# EAGLE design CB_v1 (EAGLE 7.1.0)
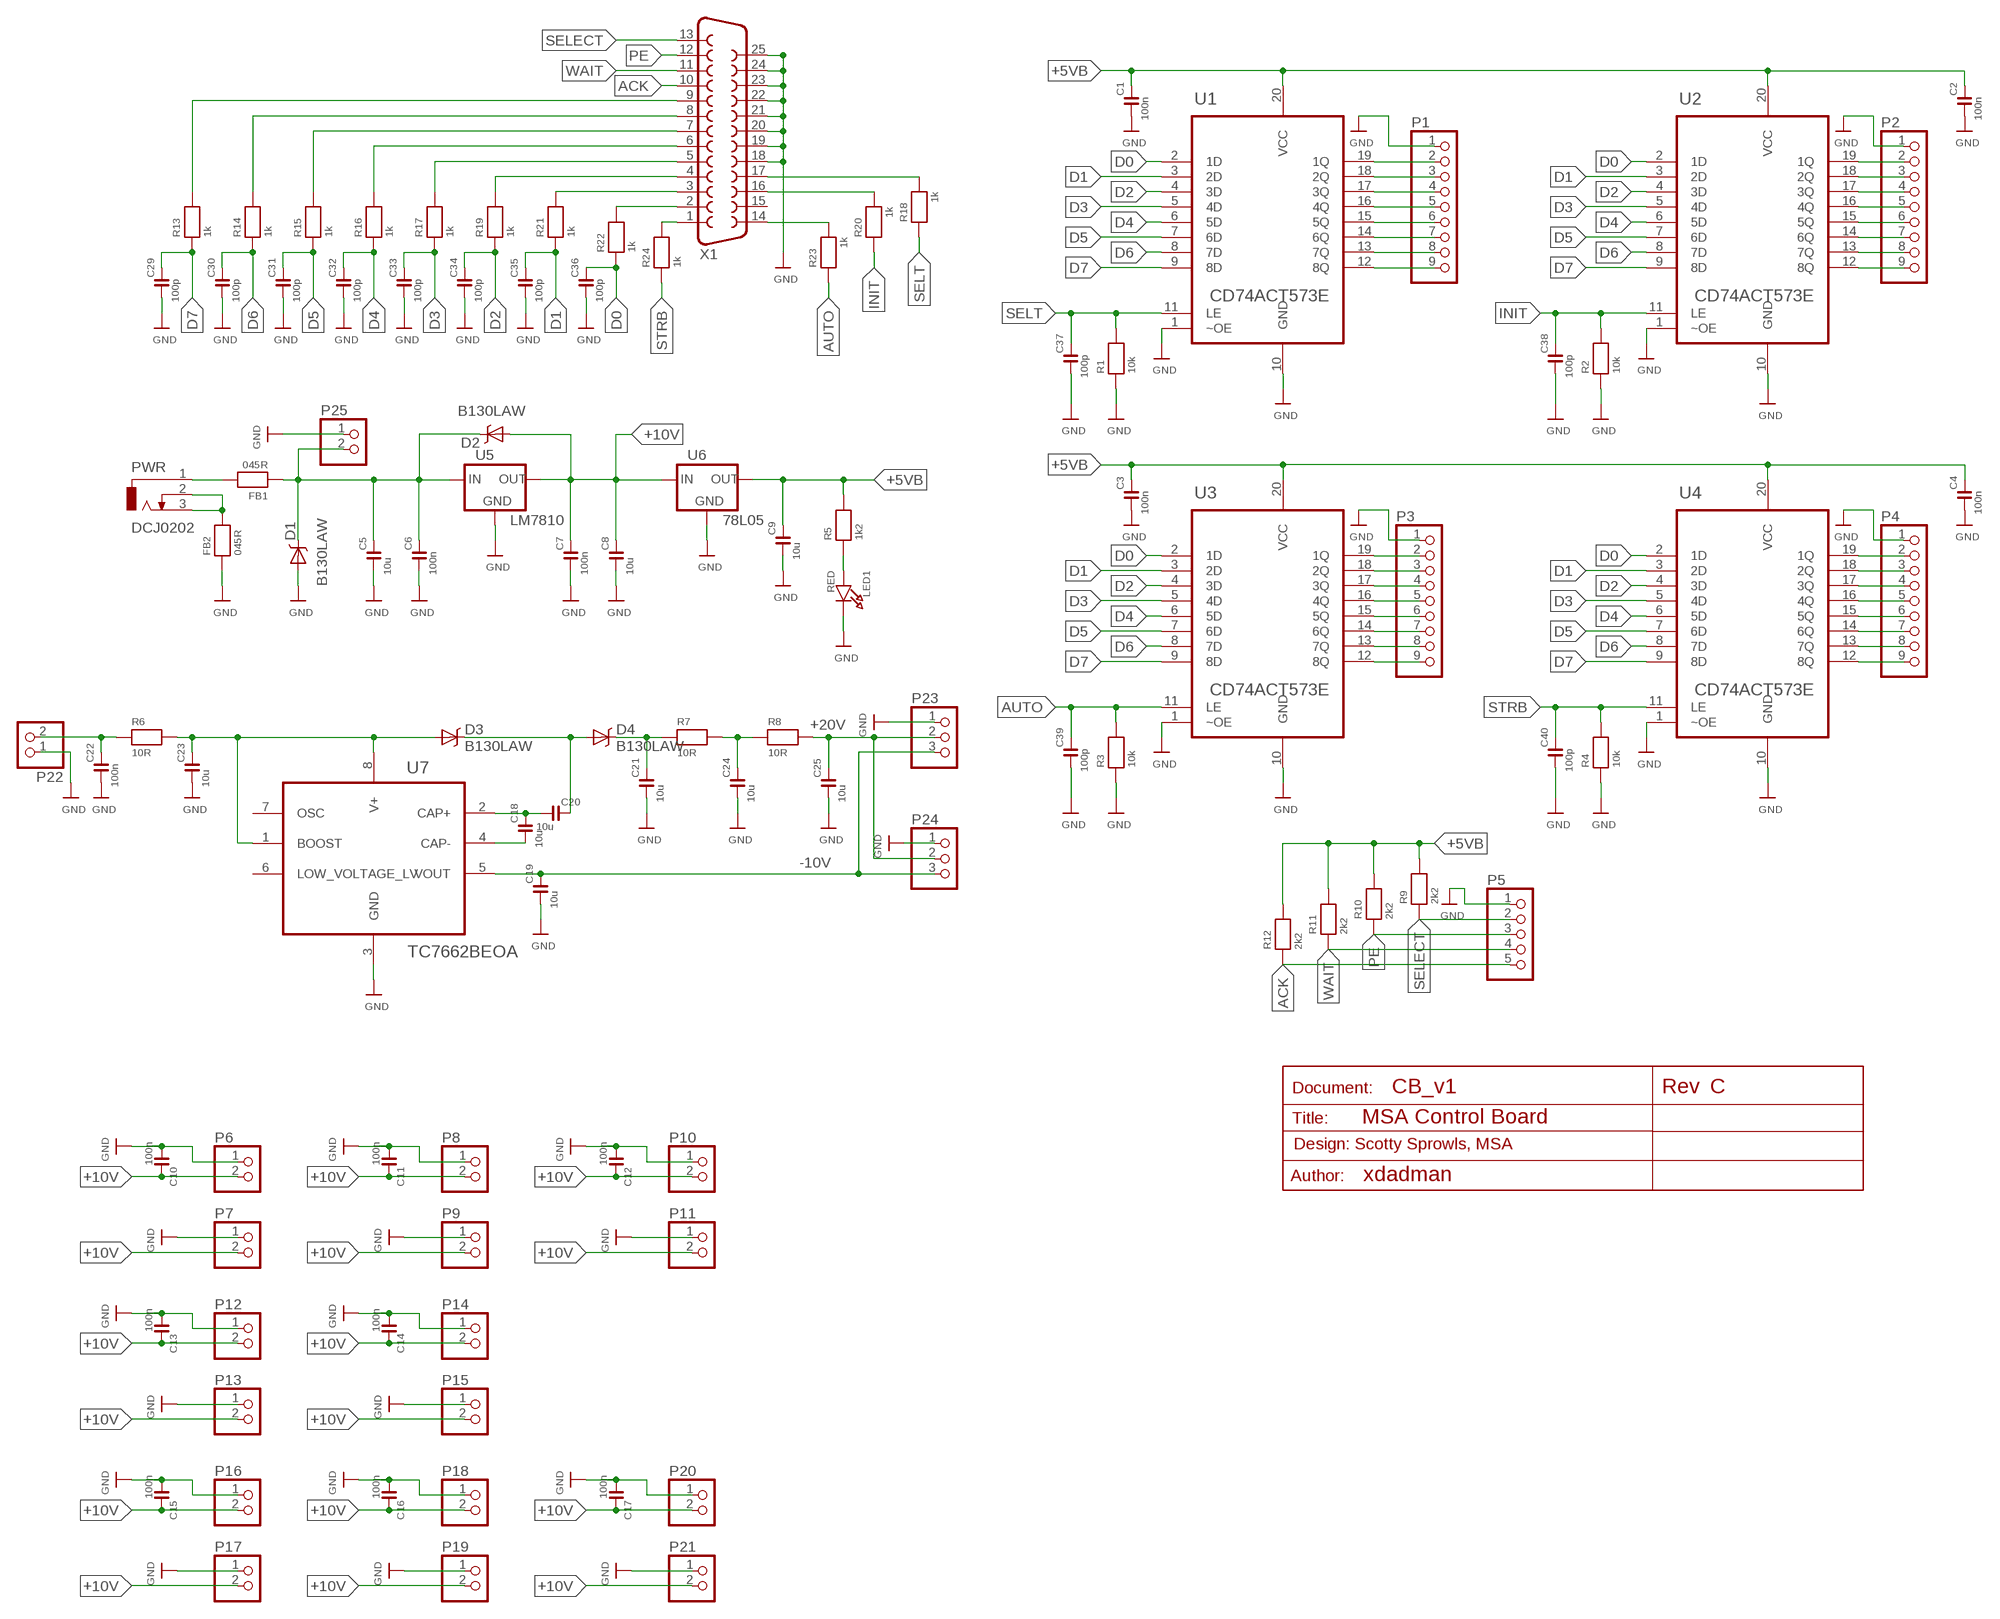
[diagram p0: schematic, sheet 1]

## Parts
C1  100n  C0805100N  [C0805]
C2  100n  C0805100N  [C0805]
C3  100n  C0805100N  [C0805]
C4  100n  C0805100N  [C0805]
C5  10u  CC120610U  [C1206]
C6  100n  C0805100N  [C0805]
C7  100n  C0805100N  [C0805]
C8  10u  CC120610U  [C1206]
C9  10u  CC120610U  [C1206]
C10  100n  C0805100N  [C0805]
C11  100n  C0805100N  [C0805]
C12  100n  C0805100N  [C0805]
C13  100n  C0805100N  [C0805]
C14  100n  C0805100N  [C0805]
C15  100n  C0805100N  [C0805]
C16  100n  C0805100N  [C0805]
C17  100n  C0805100N  [C0805]
C18  10u  CC120610U  [C1206]
C19  10u  CC120610U  [C1206]
C20  10u  CC120610U  [C1206]
C21  10u  CC120610U  [C1206]
C22  100n  C0805100N  [C0805]
C23  10u  CC120610U  [C1206]
C24  10u  CC120610U  [C1206]
C25  10u  CC120610U  [C1206]
C29  100p  C0805100P  [C0805]
C30  100p  C0805100P  [C0805]
C31  100p  C0805100P  [C0805]
C32  100p  C0805100P  [C0805]
C33  100p  C0805100P  [C0805]
C34  100p  C0805100P  [C0805]
C35  100p  C0805100P  [C0805]
C36  100p  C0805100P  [C0805]
C37  100p  C0805100P  [C0805]
C38  100p  C0805100P  [C0805]
C39  100p  C0805100P  [C0805]
C40  100p  C0805100P  [C0805]
D1  B130LAW  B130LAW-7-FB130LAW-7-F  [SOD-123]
D2  B130LAW  B130LAW-7-FB130LAW-7-F  [SOD-123]
D3  B130LAW  B130LAW-7-FB130LAW-7-F  [SOD-123]
D4  B130LAW  B130LAW-7-FB130LAW-7-F  [SOD-123]
FB1  045R  R0805FB045  [R0805]
FB2  045R  R0805FB045  [R0805]
LED1  RED  LED_0603_RED0603  [CHIPLED_0603]
P1  PINHD-1X9  [1X09ROUND]
P2  PINHD-1X9  [1X09ROUND]
P3  PINHD-1X9  [1X09ROUND]
P4  PINHD-1X9  [1X09ROUND]
P5  PINHD-1X5  [1X05]
P6  PINHD-1X2  [1X02]
P7  PINHD-1X2  [1X02]
P8  PINHD-1X2  [1X02]
P9  PINHD-1X2  [1X02]
P10  PINHD-1X2  [1X02]
P11  PINHD-1X2  [1X02]
P12  PINHD-1X2  [1X02]
P13  PINHD-1X2  [1X02]
P14  PINHD-1X2  [1X02]
P15  PINHD-1X2  [1X02]
P16  PINHD-1X2  [1X02]
P17  PINHD-1X2  [1X02]
P18  PINHD-1X2  [1X02]
P19  PINHD-1X2  [1X02]
P20  PINHD-1X2  [1X02]
P21  PINHD-1X2  [1X02]
P22  PINHD-1X2  [1X02]
P23  PINHD-1X3  [1X03]
P24  PINHD-1X3  [1X03]
P25  PINHD-1X2  [1X02]
PWR  DCJ0202  [DCJ0202]
R1  10k  R080510K  [R0805]
R2  10k  R080510K  [R0805]
R3  10k  R080510K  [R0805]
R4  10k  R080510K  [R0805]
R5  1k2  R08051K2  [R0805]
R6  10R  R080510R  [R0805]
R7  10R  R080510R  [R0805]
R8  10R  R080510R  [R0805]
R9  2k2  R08052K2  [R0805]
R10  2k2  R08052K2  [R0805]
R11  2k2  R08052K2  [R0805]
R12  2k2  R08052K2  [R0805]
R13  1k  R08051K  [R0805]
R14  1k  R08051K  [R0805]
R15  1k  R08051K  [R0805]
R16  1k  R08051K  [R0805]
R17  1k  R08051K  [R0805]
R18  1k  R08051K  [R0805]
R19  1k  R08051K  [R0805]
R20  1k  R08051K  [R0805]
R21  1k  R08051K  [R0805]
R22  1k  R08051K  [R0805]
R23  1k  R08051K  [R0805]
R24  1k  R08051K  [R0805]
U1  CD74ACT573E  [DIP254P762X508-20]
U2  CD74ACT573E  [DIP254P762X508-20]
U3  CD74ACT573E  [DIP254P762X508-20]
U4  CD74ACT573E  [DIP254P762X508-20]
U5  LM7810  78MXXLLM7810  [TO220V]
U6  78L05  78MXXL78L05  [SOT89]
U7  TC7662BEOA  [SOIC127P600X175-8N_JDA]
X1  F25D  [F25D]

## Nets
+5VB: C1.2 C2.2 C3.2 C4.2 C9.2 R5.2 R9.2 R10.2 R11.2 R12.2 U1.20(VCC) U2.20(VCC) U3.20(VCC) U4.20(VCC) U6.1(OUT)
+10V: C7.2 C8.2 C10.2 C11.2 C12.2 C13.2 C14.2 C15.2 C16.2 C17.2 D2.A P6.2 P7.2 P8.2 P9.2 P10.2 P11.2 P12.2 P13.2 P14.2 P15.2 P16.2 P17.2 P18.2 P19.2 P20.2 P21.2 U5.3(OUT) U6.3(IN)
+20V: C25.2 P23.2 P24.2 R8.2
-10V: C19.2 P23.3 P24.3 U7.5(VOUT)
ACK: P5.5 R12.1 X1.10
AUTO: C39.2 R3.2 R23.2 U3.11(LE)
D0: C36.2 R22.1 U1.2(1D) U2.2(1D) U3.2(1D) U4.2(1D)
D1: C35.2 R21.1 U1.3(2D) U2.3(2D) U3.3(2D) U4.3(2D)
D2: C34.2 R19.1 U1.4(3D) U2.4(3D) U3.4(3D) U4.4(3D)
D3: C33.2 R17.1 U1.5(4D) U2.5(4D) U3.5(4D) U4.5(4D)
D4: C32.2 R16.1 U1.6(5D) U2.6(5D) U3.6(5D) U4.6(5D)
D5: C31.2 R15.1 U1.7(6D) U2.7(6D) U3.7(6D) U4.7(6D)
D6: C30.2 R14.1 U1.8(7D) U2.8(7D) U3.8(7D) U4.8(7D)
D7: C29.2 R13.1 U1.9(8D) U2.9(8D) U3.9(8D) U4.9(8D)
GND: C1.1 C2.1 C3.1 C4.1 C5.1 C6.1 C7.1 C8.1 C9.1 C10.1 C11.1 C12.1 C13.1 C14.1 C15.1 C16.1 C17.1 C19.1 C21.1 C22.1 C23.1 C24.1 C25.1 C29.1 C30.1 C31.1 C32.1 C33.1 C34.1 C35.1 C36.1 C37.1 C38.1 C39.1 C40.1 D1.A FB2.1 LED1.C P1.1 P2.1 P3.1 P4.1 P5.1 P6.1 P7.1 P8.1 P9.1 P10.1 P11.1 P12.1 P13.1 P14.1 P15.1 P16.1 P17.1 P18.1 P19.1 P20.1 P21.1 P22.1 P23.1 P24.1 P25.1 R1.1 R2.1 R3.1 R4.1 U1.1(~OE) U1.10(GND) U2.1(~OE) U2.10(GND) U3.1(~OE) U3.10(GND) U4.1(~OE) U4.10(GND) U5.2(GND) U6.2(GND) U6.4(GND) U7.3(GND) X1.18 X1.19 X1.20 X1.21 X1.22 X1.23 X1.24 X1.25
INIT: C38.2 R2.2 R20.2 U2.11(LE)
N$1: P1.2 U1.19(1Q)
N$2: P3.2 U3.19(1Q)
N$3: P2.2 U2.19(1Q)
N$4: P4.2 U4.19(1Q)
N$5: R22.2 X1.2
N$6: R18.1 X1.17
N$7: R21.2 X1.3
N$8: R19.2 X1.4
N$9: R13.2 X1.9
N$10: R23.1 X1.14
N$11: R20.1 X1.16
N$12: R14.2 X1.8
N$13: R15.2 X1.7
N$14: R16.2 X1.6
N$15: R17.2 X1.5
N$16: FB1.2 PWR.1
N$17: P1.3 U1.18(2Q)
N$18: P1.4 U1.17(3Q)
N$19: R24.2 X1.1
N$20: FB2.2 PWR.2 PWR.3
N$21: C5.2 C6.2 D1.C D2.C FB1.1 P25.2 U5.1(IN)
N$22: LED1.A R5.1
N$23: C23.2 D3.A R6.2 U7.1(BOOST) U7.8(V+)
N$24: C22.2 P22.2 R6.1
N$25: C20.2 D3.C D4.A
N$26: C21.2 D4.C R7.1
N$27: P1.5 U1.16(4Q)
N$28: C18.1 U7.4(CAP-)
N$30: C18.2 C20.1 U7.2(CAP+)
N$31: C24.2 R7.2 R8.1
N$33: P1.6 U1.15(5Q)
N$34: P1.7 U1.14(6Q)
N$35: P1.8 U1.13(7Q)
N$36: P1.9 U1.12(8Q)
N$37: P2.3 U2.18(2Q)
N$38: P2.4 U2.17(3Q)
N$39: P2.5 U2.16(4Q)
N$40: P2.6 U2.15(5Q)
N$41: P2.7 U2.14(6Q)
N$42: P2.8 U2.13(7Q)
N$43: P2.9 U2.12(8Q)
N$44: P3.3 U3.18(2Q)
N$45: P3.4 U3.17(3Q)
N$46: P3.5 U3.16(4Q)
N$47: P3.6 U3.15(5Q)
N$48: P3.7 U3.14(6Q)
N$49: P3.8 U3.13(7Q)
N$50: P3.9 U3.12(8Q)
N$51: P4.3 U4.18(2Q)
N$52: P4.4 U4.17(3Q)
N$53: P4.5 U4.16(4Q)
N$54: P4.6 U4.15(5Q)
N$55: P4.7 U4.14(6Q)
N$56: P4.8 U4.13(7Q)
N$57: P4.9 U4.12(8Q)
PE: P5.3 R10.1 X1.12
SELECT: P5.2 R9.1 X1.13
SELT: C37.2 R1.2 R18.2 U1.11(LE)
STRB: C40.2 R4.2 R24.1 U4.11(LE)
WAIT: P5.4 R11.1 X1.11
Unconnected: U7.6(LOW_VOLTAGE_LV) U7.7(OSC) X1.15

## Notes on the sheet
- C
- MSA Control Board
- Design: Scotty Sprowls, MSA
- xdadman

## Library data of the parts
C1-C4 C6 C7 C10-C17 C22 = MSA_lib:C0805: Ceramic capacitor; OC_FARNELL: 1759166
C5 C8 C9 C18-C21 C23-C25 = MSA_lib:CC1206: Capacitor ceramic 1206; OC_FARNELL: 1611967
C29-C40 = MSA_lib:C0805: Ceramic capacitor; OC_FARNELL: 1414656
D1-D4 = MSA_lib:B130LAW-7-F: Diode shottky; OC_FARNELL: 1858617
FB1 FB2 = MSA_lib:R0805: Resistors; OC_FARNELL: 1515661
LED1 = MSA_lib:LED_0603_RED: Chip LED 0603 RED 2ma; OC_FARNELL: 1685068
P1-P4 = MSA_lib:PINHD-1X9: PIN HEADER
P5 = MSA_lib:PINHD-1X5: PIN HEADER
P6-P22 P25 = MSA_lib:PINHD-1X2: PIN HEADER
P23 P24 = MSA_lib:PINHD-1X3: PIN HEADER
PWR = MSA_lib:DCJ0202: DC POWER JACK Source: DCJ0202.pdf; OC_FARNELL: unknown; OC_NEWARK: unknown
R1-R4 = MSA_lib:R0805: Resistors; OC_FARNELL: 2073607
R5 = MSA_lib:R0805: Resistors; OC_FARNELL: 9333827
R6-R8 = MSA_lib:R0805: Resistors; OC_FARNELL: 2332043
R9-R12 = MSA_lib:R0805: Resistors; OC_FARNELL: 2332076
R13-R24 = MSA_lib:R0805: Resistors; OC_FARNELL: 2008380
U1-U4 = MSA_lib:CD74ACT573E: OCTAL D- TYPE TRANSPARENT LATCHES WITH 3 STATE OUTPUTS; MPN: CD74ACT573E; OC_FARNELL: 1102996; PACKAGE: 20-DIP; SUPPLIER: Texas Instruments
U5 = MSA_lib:78MXXL: VOLTAGE REGULATOR; OC_FARNELL: 2323459
U6 = MSA_lib:78MXXL: VOLTAGE REGULATOR; OC_FARNELL: 1366573
U7 = MSA_lib:TC7662BEOA: DC-TO-DC VOLTAGE CONVERTER; MPN: TC7662BEOA; OC_FARNELL: 1331515; OC_NEWARK: 75K1581; PACKAGE: SOIC-8; SUPPLIER: Microchip
X1 = MSA_lib:F25: SUB-D; OC_FARNELL: 2294235; OC_NEWARK: unknown

## Board
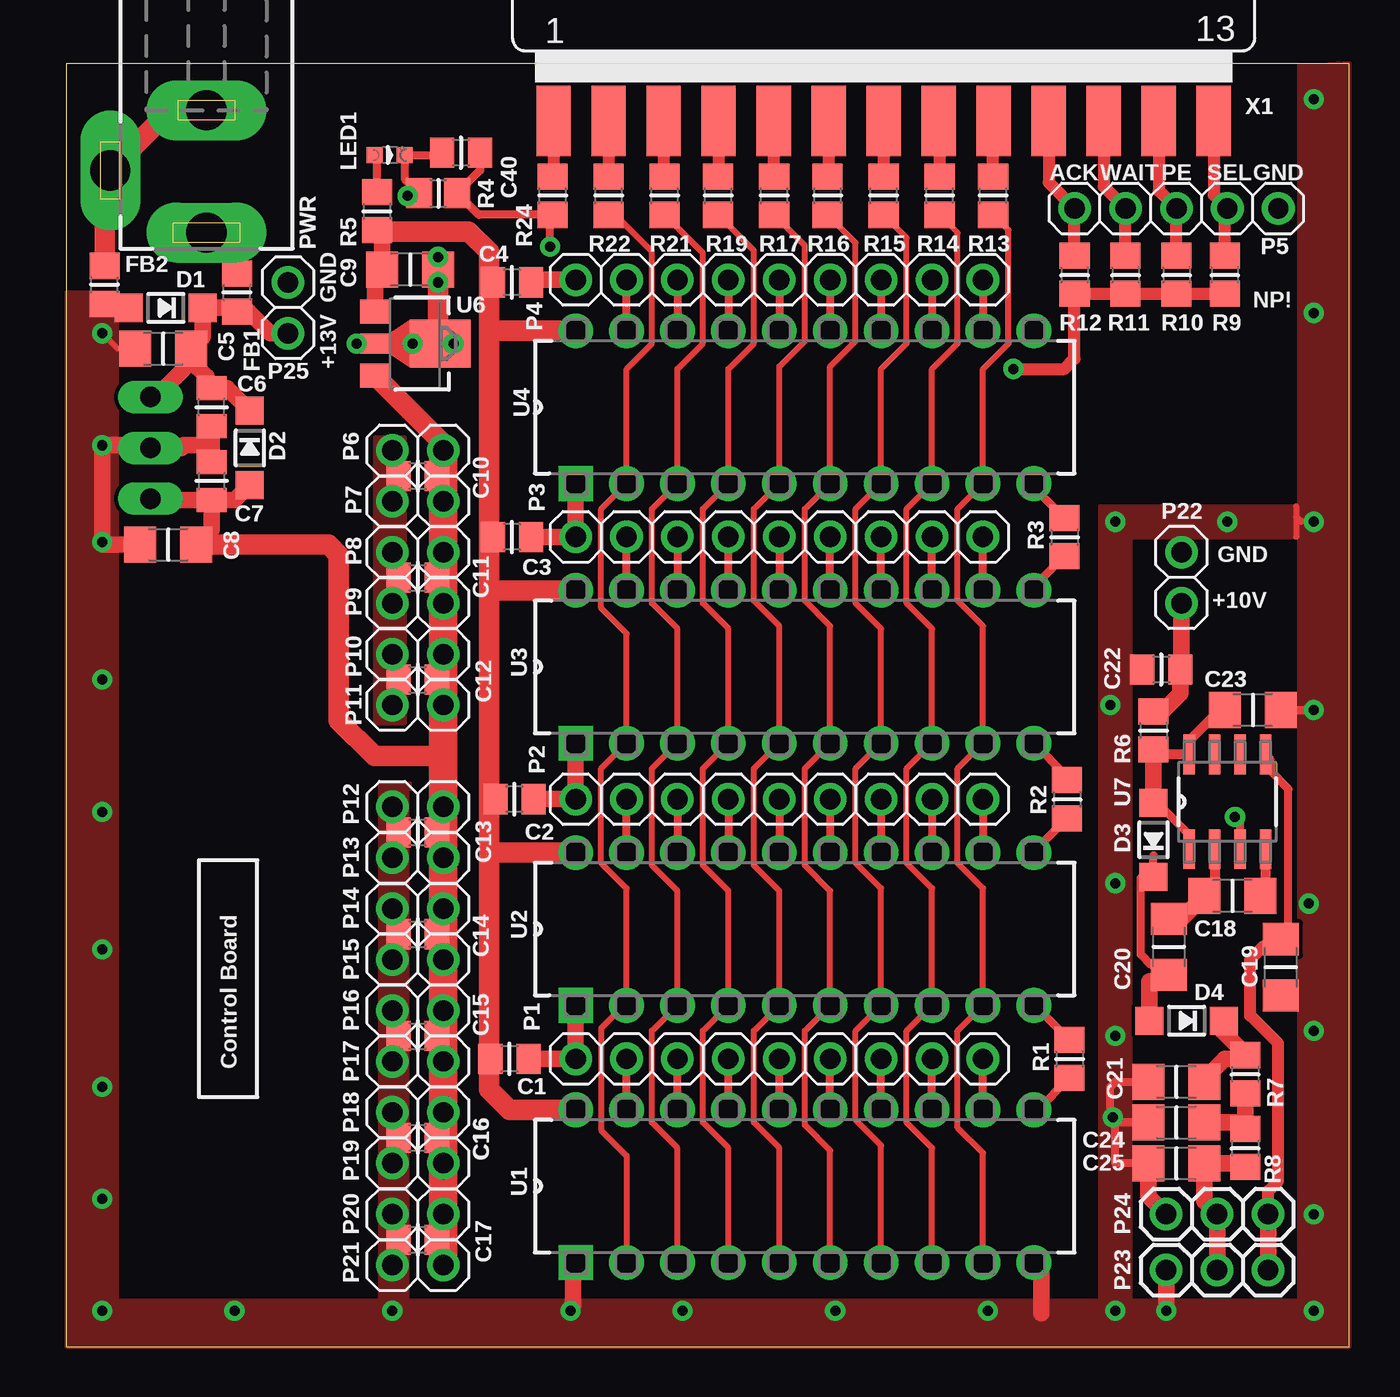
[diagram p1: board, top side]
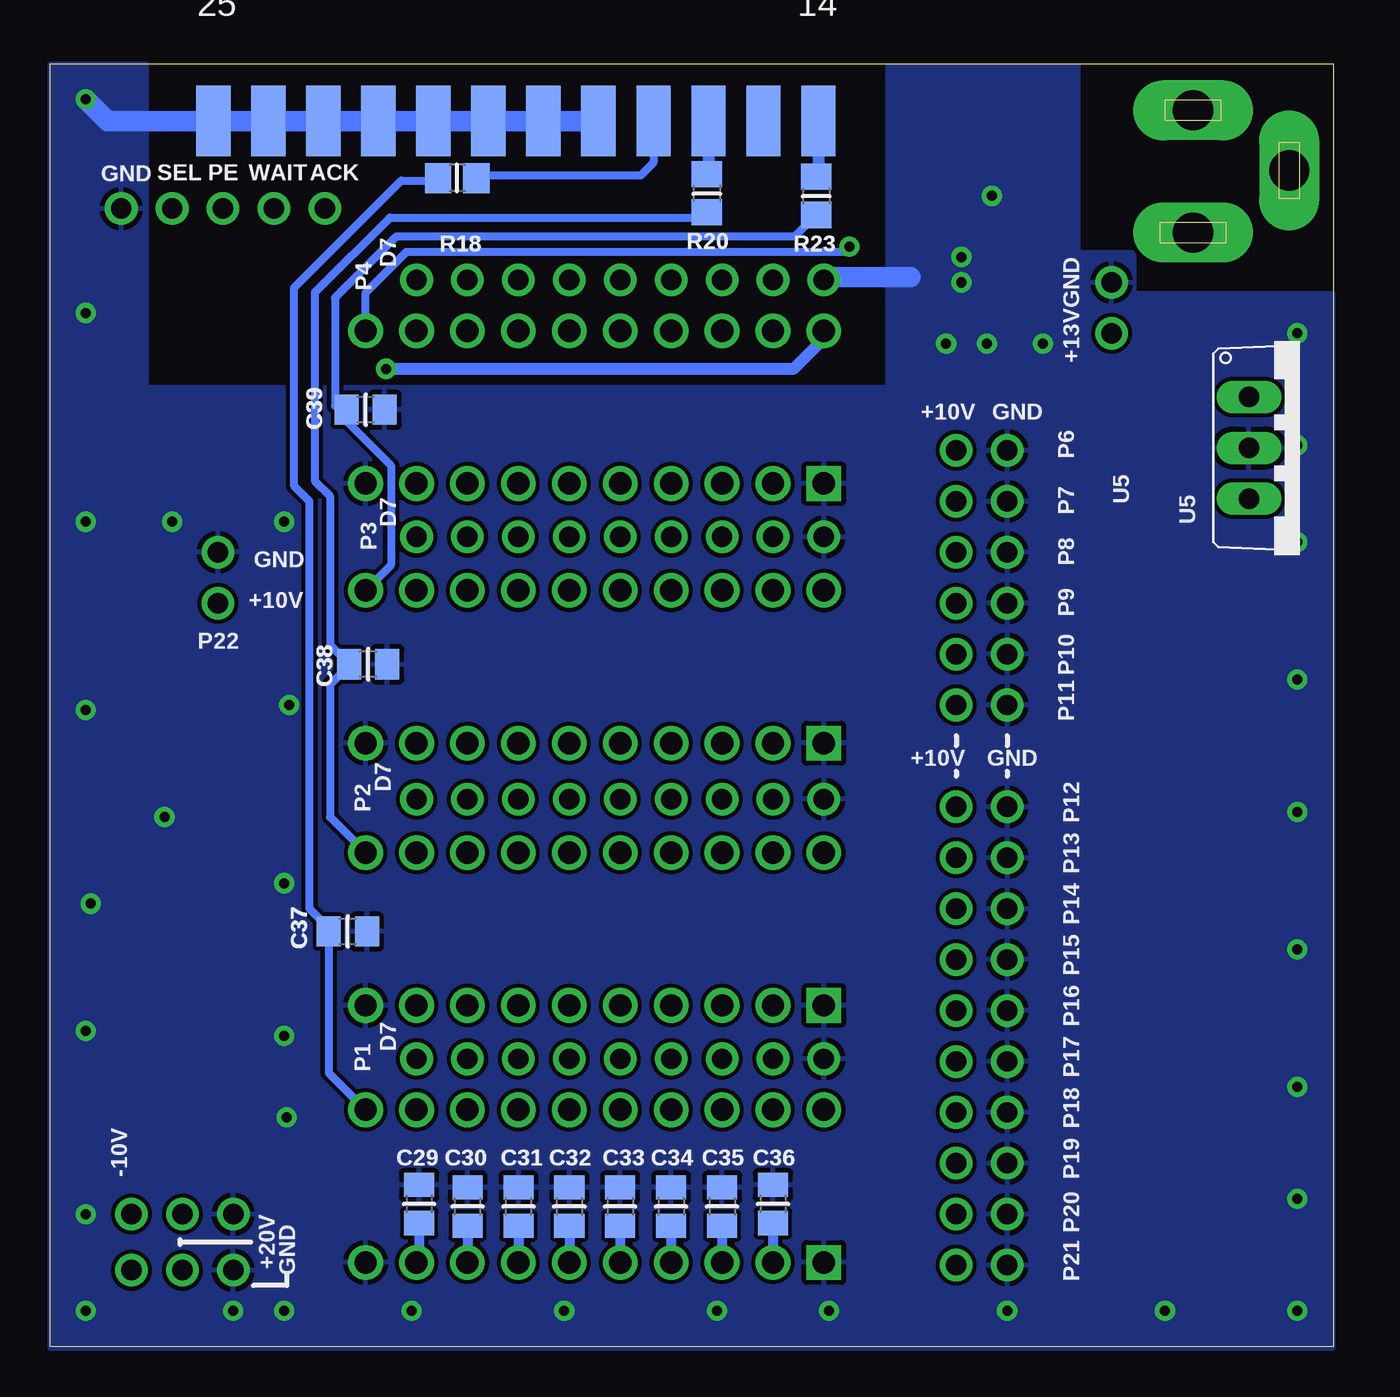
[diagram p2: board, bottom side, seen from below]

Size 64 x 64 mm. Coordinates in mm from the lower left corner, seen from the top.
Outline: 0,0 64,0 64,64 0,64 0,0
Copper layers (1*16): Top 0.035mm / dielectric 1.5mm / Bottom 0.035mm
Design rules "kuba_no_CLR": minimum track width 8mil, minimum drill 15mil, track to track 8mil, track to pad 8mil, pad to pad 8mil, via to via 8mil, smd to smd 8mil, copper to edge 0mil, drill to drill 8mil, minimum pad ring 12mil, minimum via ring 10mil, stop-mask expansion 4mil, vias tented up to drill 0mil, thermal gap 10mil

### Footprints (pad centres in the part's own frame; a part is rotated, then mirrored left to right if it is on the bottom)
C0805 = smd 1.2 x 1.5: 1 -0.953,0; 2 0.953,0
C1206 = smd 1.6 x 1.8: 1 -1.4,0; 2 1.4,0
SOD-123 = smd 1.4 x 1.4: A 1.85,0; C -1.85,0
R0805 = smd 1.3 x 1.5: 1 -0.95,0; 2 0.95,0
CHIPLED_0603 = smd 0.8 x 0.8: A 0,-0.75; C 0,0.75
1X09ROUND = drill 1.016: 1 -10.16,0; 2 -7.62,0; 3 -5.08,0; 4 -2.54,0; 5 0,0; 6 2.54,0; 7 5.08,0; 8 7.62,0; 9 10.16,0
1X05 = drill 1.016: 1 -5.08,0; 2 -2.54,0; 3 0,0; 4 2.54,0; 5 5.08,0
1X02 = drill 1.016: 1 -1.27,0; 2 1.27,0
1X03 = drill 1.016: 1 -2.54,0; 2 0,0; 3 2.54,0
DCJ0202 = drill 2 long: 1 0,3.1; 2 4.8,0; 3 0,-3
DIP254P762X508-20 = drill 1.118 square: 1 -7.62,22.86 | drill 1.118: 2 -7.62,20.32; 3 -7.62,17.78; 4 -7.62,15.24; 5 -7.62,12.7; 6 -7.62,10.16; 7 -7.62,7.62; 8 -7.62,5.08; 9 -7.62,2.54; 10 -7.62,0; 11 0,0; 12 0,2.54; 13 0,5.08; 14 0,7.62; 15 0,10.16; 16 0,12.7; 17 0,15.24; 18 0,17.78; 19 0,20.32; 20 0,22.86
TO220V = drill 1.016 long: 1 -2.54,-2.54; 2 0,-2.54; 3 2.54,-2.54
SOT89 = smd 1.2 x 1.5: 1 -1.6,-2; 3 1.6,-2 | smd 1 x 1.5: 2 0,-2 | smd 2.4 x 3: 4 0,1.25
SOIC127P600X175-8N_JDA = smd 1.981 x 0.559: 1 -2.362,1.905; 2 -2.362,0.635; 3 -2.362,-0.635; 4 -2.362,-1.905; 5 2.362,-1.905; 6 2.362,-0.635; 7 2.362,0.635; 8 2.362,1.905
F25D = smd 1.7 x 3.5: 1 -16.459,-6.045; 2 -13.716,-6.045; 3 -10.973,-6.045; 4 -8.23,-6.045; 5 -5.486,-6.045; 6 -2.743,-6.045; 7 0,-6.045; 8 2.743,-6.045; 9 5.486,-6.045; 10 8.23,-6.045; 11 10.973,-6.045; 12 13.716,-6.045; 13 16.459,-6.045 | smd 1.7 x 3.5 bottom: 14 -15.088,-6.045; 15 -12.344,-6.045; 16 -9.601,-6.045; 17 -6.858,-6.045; 18 -4.115,-6.045; 19 -1.372,-6.045; 20 1.372,-6.045; 21 4.115,-6.045; 22 6.858,-6.045; 23 9.601,-6.045; 24 12.344,-6.045; 25 15.088,-6.045

### Placement (x,y rotation side)
C1  22.1,14.35 180 top
C2  22.35,27.3 180 top
C3  22.23,40.39 180 top
C4  22.23,53.09 180 top
C5  4.83,49.78 0 top
C6  7.24,46.86 90 top
C7  7.24,43.18 270 top
C8  5.08,40.01 0 top
C9  17.14,53.72 180 top
C10  17.53,43.43 0 top
C11  17.53,38.35 0 top
C12  17.53,33.27 0 top
C13  17.53,25.65 0 top
C14  17.53,20.57 0 top
C15  17.53,15.49 0 top
C16  17.53,10.41 0 top
C17  17.53,5.33 0 top
C18  58.17,22.48 180 top
C19  60.58,18.92 90 top
C20  54.99,19.94 270 top
C21  55.37,13.21 0 top
C22  54.61,33.78 0 top
C23  59.18,31.75 180 top
C24  55.37,11.18 0 top
C25  55.37,9.14 0 top
C29  45.59,7.11 270 bottom
C30  43.18,6.99 270 bottom
C31  40.64,6.99 270 bottom
C32  38.1,6.99 270 bottom
C33  35.56,6.99 270 bottom
C34  33.02,6.99 270 bottom
C35  30.48,6.99 270 bottom
C36  27.94,7.11 270 bottom
C37  49.15,20.7 180 bottom
C38  48.13,34.04 180 bottom
C39  48.26,46.74 180 bottom
C40  19.68,59.56 0 top
D1  4.95,51.82 180 top
D2  9.14,44.83 270 top
D3  54.23,25.27 90 top
D4  55.88,16.26 180 top
FB1  8.51,52.58 90 top
FB2  1.91,52.96 90 top
LED1  16.13,59.44 270 top
P1  35.56,14.35 0 top
P2  35.56,27.3 0 top
P3  35.56,40.39 0 top
P4  35.56,53.21 0 top
P5  55.37,56.77 180 top
P6  17.53,44.7 0 top
P7  17.53,42.16 0 top
P8  17.53,39.62 0 top
P9  17.53,37.08 0 top
P10  17.53,34.54 0 top
P11  17.53,32 0 top
P12  17.53,26.92 0 top
P13  17.53,24.38 0 top
P14  17.53,21.84 0 top
P15  17.53,19.3 0 top
P16  17.53,16.76 0 top
P17  17.53,14.22 0 top
P18  17.53,11.68 0 top
P19  17.53,9.14 0 top
P20  17.53,6.6 0 top
P21  17.53,4.06 0 top
P22  55.63,38.35 270 top
P23  57.4,3.81 0 top
P24  57.4,6.6 0 top
P25  11.05,51.82 270 top
PWR  6.99,58.67 180 top
R1  50.04,14.35 270 top
R2  49.91,27.3 270 top
R3  49.78,40.39 270 top
R4  18.54,57.53 0 top
R5  15.49,56.64 270 top
R6  54.23,30.73 270 top
R7  58.8,13.59 270 top
R8  58.8,9.91 270 top
R9  57.78,53.47 270 top
R10  55.37,53.47 270 top
R11  52.83,53.47 270 top
R12  50.29,53.47 270 top
R13  46.23,57.4 90 top
R14  43.56,57.4 90 top
R15  40.77,57.4 90 top
R16  37.97,57.4 90 top
R17  35.31,57.4 90 top
R18  43.69,58.29 180 bottom
R19  32.51,57.4 90 top
R20  31.24,57.53 270 bottom
R21  29.84,57.4 90 top
R22  27.05,57.4 90 top
R23  25.78,57.4 270 bottom
R24  24.26,57.4 90 top
U1  48.26,11.81 90 top
U2  48.26,24.64 90 top
U3  48.26,37.72 90 top
U4  48.26,50.67 90 top
U5  1.65,44.83 270 bottom
U6  17.4,50.04 270 top
U7  57.91,27.18 90 top
X1  40.77,67.18 0 top

### Tracks (layer width: path | path; a pad name or v marks a point on that pad's centre or on a via)
+5VB  (via drill 0.5)
  Top 0.305: C4.2 21.27,53.02 21.08,52.83 | C3.2 21.27,38.8 21.08,38.61 | C2.2 21.4,25.46 21.08,25.15 | C1.2 21.14,13.4 21.08,13.34
  Top 0.61: v47.24,48.77 49.78,48.77 50.29,49.28 R12.2 R11.2 R10.2 R9.2
  Top 0.813: U6.1 15.4,53.38 C9.2 15.74,55.44 R5.2
  Top 1.016: 21.08,50.93 21.08,52.83 21.08,54.61 20.07,55.63 15.56,55.63 R5.2 | 21.08,50.93 21.08,38.61 21.08,37.85 | 21.08,37.85 21.08,25.15 21.08,24.51 | 21.08,24.51 21.08,13.34 21.08,12.83 22.1,11.81 U1.20 | U2.20 21.21,24.64 21.08,24.51 | U3.20 21.21,37.72 21.08,37.85 | U4.20 21.34,50.67 21.08,50.93
  Bottom 0.61: U4.20 25.4,50.29 26.92,48.77 v47.24,48.77
+10V
  Top 0.813: C7.2 4.25,42.23 U5.3 | C7.2 8.39,42.23 D2.A | C7.2 7.24,40.76 C8.2 | P6.2 18.8,43.75 C10.2 | P8.2 18.8,38.67 C11.2 | P10.2 18.8,33.59 C12.2 | P12.2 18.8,25.97 C13.2 | P14.2 18.8,20.89 C14.2 | P16.2 18.8,15.81 C15.2 | P18.2 18.8,10.73 C16.2 | P20.2 18.8,5.65 C17.2
  Top 1.016: U6.3 18.8,45.04 P6.2 | C8.2 13.08,40.01 13.59,39.5 13.59,31.24 15.37,29.46 18.8,29.46
  Top 1.422: P6.2 P7.2 P8.2 P9.2 P10.2 P11.2 18.8,29.46 P12.2 P13.2 P14.2 P15.2 P16.2 P17.2 P18.2 P19.2 P20.2 P21.2
+20V
  Top 0.813: R8.2 58.61,9.14 C25.2 56.77,7.24 P24.2 P23.2
-10V
  Top 0.406: C19.2 60.58,20.7 60.96,21.08 60.96,27.81 60.07,28.7 60.07,29.29 U7.5
  Top 0.61: P24.3 59.94,7.75 60.45,8.26 60.45,15.11 59.05,16.51 59.05,19.3 59.69,19.94 60.2,19.94 C19.2
  Top 0.813: P24.3 P23.3
ACK
  Top 0.61: X1.10 49,58.06 P5.5 R12.1
AUTO
  Top 0.406: U3.11 48.26,37.91 R3.2
  Bottom 0.406: 25.84,56.45 R23.2 26.86,55.37 46.74,55.37 49.78,52.32 49.78,46.93 49.4,46.93 C39.2 49.21,46.16 46.99,43.94 46.99,38.99 U3.11
D0
  Top 0.305: U1.2 27.94,9.53 26.67,10.79 26.67,15.88 27.81,17.02 U2.2 27.94,22.86 26.67,24.13 26.67,28.83 U3.2 27.94,35.56 26.67,36.83 26.67,41.78 U4.2 27.94,48.77 29.21,50.04 29.21,54.61 27.56,56.26 27.24,56.26 R22.1
  Bottom 0.508: C36.2 U1.2
D1
  Top 0.305: U1.3 30.48,9.91 29.21,11.18 29.21,15.75 U2.3 30.48,22.73 29.21,24 29.21,28.83 U3.3 30.48,35.81 29.21,37.08 29.21,41.78 U4.3 30.48,48.77 31.75,50.04 31.75,54.55 R21.1
  Bottom 0.508: C35.2 U1.3
D2
  Top 0.305: U1.4 33.02,9.91 31.75,11.18 31.75,15.75 U2.4 33.02,22.73 31.75,24 31.75,28.83 U3.4 33.02,35.81 31.75,37.08 31.75,41.78 U4.4 33.02,48.77 34.29,50.04 34.29,54.68 R19.1
  Bottom 0.508: C34.2 U1.4
D3
  Top 0.305: U1.5 35.56,9.91 34.29,11.18 34.29,15.75 U2.5 35.56,22.73 34.29,24 34.29,28.83 U3.5 35.56,35.94 34.29,37.21 34.29,41.78 U4.5 35.56,48.9 36.83,50.16 36.83,54.93 R17.1
  Bottom 0.508: C33.2 U1.5
D4
  Top 0.305: U1.6 38.1,9.78 36.83,11.05 36.83,15.75 U2.6 38.1,22.73 36.83,24 36.83,28.83 U3.6 38.1,35.94 36.83,37.21 36.83,41.78 U4.6 38.1,48.9 39.37,50.16 39.37,55.06 R16.1
  Bottom 0.508: C32.2 U1.6
D5
  Top 0.305: U1.7 40.64,10.03 39.37,11.3 39.37,15.75 U2.7 40.64,22.86 39.37,24.13 39.37,28.83 U3.7 40.64,35.81 39.37,37.08 39.37,41.78 U4.7 40.64,48.77 41.91,50.04 41.91,55.31 R15.1
  Bottom 0.508: C31.2 U1.7
D6
  Top 0.305: U1.8 43.18,9.91 41.91,11.18 41.91,15.75 U2.8 43.18,22.86 41.91,24.13 41.91,28.83 U3.8 43.18,35.81 41.91,37.08 41.91,41.78 U4.8 43.18,48.77 44.45,50.04 44.45,55.56 R14.1
  Bottom 0.508: C30.2 U1.8
D7
  Top 0.305: U1.9 45.72,9.65 44.45,10.92 44.45,15.75 U2.9 45.72,22.86 44.45,24.13 44.45,28.83 U3.9 45.72,35.94 44.45,37.21 44.45,41.78 U4.9 45.72,48.77 46.99,50.04 46.99,55.69 R13.1
  Bottom 0.508: C29.2 45.59,4.32 U1.9
GND  (via drill 0.5)
  Top 0.305: C5.1 2.54,49.78 v1.78,50.55 | 61.34,41.91 61.34,41.4 | 61.34,41.4 61.34,40.39 | v62.23,41.15 61.59,41.15 61.34,41.4 | C9.1 v18.55,53.09 v18.54,53.09
  Top 0.406: U2.10 48.32,17.02 R1.1 | R2.1 49.91,28.45 U3.10 | U4.10 48.26,42.86 R3.1 | C40.1 18.61,59.44 LED1.C 16.88,58.24 R4.1 | U7.3 58.55,26.16 v58.29,26.42 | C23.1 v62.23,31.75 | C25.1 52.32,9.14 52.32,11.18 C24.1 52.07,11.18 52.07,12.95 52.32,13.21 C21.1
  Top 0.813: U1.1 25.27,4.19 25.27,2.03 | U1.10 48.64,4.19 48.64,1.65 | P23.1 54.86,1.91 | C1.1 P1.1 U2.1 | C2.1 P2.1 U3.1 | C3.1 P3.1 U4.1 | P4.1 23.3,53.21 C4.1 | U6.2 U6.4 | C6.1 7.24,44.96 | 7.24,44.96 C7.1 | 7.24,44.96 5.84,44.96 5.71,44.83 U5.2 4.06,44.96 v1.78,44.96 1.78,40.01 C8.1 | C25.1 53.97,7.5 P24.1
  Top 1.016: C9.1 18.55,50.14 U6.4 | v17.02,57.4 17.46,57.4 R4.1
  Bottom 0.305: 25.4,53.34 P4.1
  Bottom 0.406: v58.29,26.42 58.29,26.16
  Bottom 1.016: X1.18 X1.19 X1.20 X1.21 X1.22 X1.23 X1.24 X1.25 61.14,61.14 v62.23,62.23 | 25.4,53.34 21.08,53.34
  other vias: 62.23,51.56 61.98,22.1 62.23,15.75 62.23,6.6 62.23,1.78 54.86,1.78 52.32,1.78 52.2,11.43 52.32,15.49 52.32,23.11 52.07,32 52.32,41.15 57.91,41.15 45.97,1.78 38.35,1.78 30.73,1.78 25.15,1.78 16.26,1.78 8.38,1.78 1.78,1.78 1.78,7.37 1.78,12.95 1.78,19.81 1.78,26.67 1.78,33.27 1.78,40.13 14.48,50.04 17.27,50.04 14.48,50.04 19.3,50.04 19.3,50.04 18.54,54.36
  pour Top (no thermals): 0,0 64.01,0 64.01,64.01 61.85,63.88 61.47,63.88 61.47,2.29 53.09,2.29 53.09,40.39 61.21,40.39 61.21,41.91 51.56,41.91 51.56,2.29 17.02,2.29 17.02,27.81 17.14,27.81 17.14,28.07 15.62,28.07 15.62,2.29 2.54,2.29 2.54,52.58 0,52.58
  pour Top (no thermals): 16.89,45.34 15.37,45.34 15.37,31.11 16.89,31.11
  pour Bottom: 0,-0.13 64.01,-0.13 64.01,64.01 59.18,64.01 59.18,47.88 22.23,47.88 22.23,63.88 12.7,63.88 12.7,54.61 9.91,54.61 9.91,52.58 0,52.58
INIT
  Top 0.406: U2.11 48.26,24.7 R2.2
  Bottom 0.406: 31.3,56.58 R20.2 31.43,56.39 31.75,56.39 31.81,56.33 47.05,56.33 50.8,52.58 50.8,43.18 50.04,42.42 50.04,34.99 C38.2 49.09,33.97 50.04,33.02 50.04,26.42 U2.11
N$1
  Top 0.406: U1.19 P1.2
N$2
  Top 0.406: U3.19 P3.2
N$3
  Top 0.406: U2.19 P2.2
N$4
  Top 0.406: U4.19 P4.2
N$5
  Top 0.61: X1.2 R22.2
N$6
  Bottom 0.406: X1.17 33.91,59.05 34.54,58.42 42.61,58.42 R18.1
N$7
  Top 0.61: X1.3 29.79,58.41 R21.2
N$8
  Top 0.61: X1.4 32.54,58.38 R19.2
N$9
  Top 0.61: R13.2 46.23,61.11 X1.9
N$10
  Bottom 0.61: X1.14 25.68,58.46 R23.1
N$11
  Bottom 0.406: 31.17,58.3 31.17,58.41 R20.1
  Bottom 0.61: X1.16 31.17,58.3
N$12
  Top 0.61: R14.2 43.56,61.09 X1.8
N$13
  Top 0.61: X1.7 R15.2
N$14
  Top 0.61: X1.6 38.02,58.41 R16.2
N$15
  Top 0.61: X1.5 35.28,58.38 R17.2
N$16
  Top 0.813: FB1.2 8.51,54.74 8.13,55.12 7.44,55.12 PWR.1
N$17
  Top 0.406: U1.18 P1.3
N$18
  Top 0.406: U1.17 P1.4
N$19
  Top 0.61: X1.1 24.31,58.41 R24.2
N$20
  Top 1.016: FB2.2 1.91,58.39 PWR.2 5.18,61.67 PWR.3
N$21
  Top 0.813: P25.2 10.16,50.55 9.08,51.63 FB1.1 8.32,51.82 D1.C 6.8,50.36 C5.2 6.23,49.15 | 6.23,49.15 6.99,48.39 6.99,48.07 C6.2 8.01,47.82 D2.C | U5.1 4.45,47.37 6.23,49.15
N$22
  Top 0.406: R5.1 15.49,59.32 LED1.A
N$23
  Top 0.406: D3.A 54.41,27.12 55.88,25.65 55.88,24.94 U7.1
  Top 0.508: R6.2 54.47,29.54 U7.8 56.01,30.23 57.15,31.37 57.4,31.37 C23.2
  Top 0.813: D3.A R6.2
N$24
  Top 0.508: R6.1 54.29,31.68
  Top 0.813: P22.2 55.63,33.85 C22.2 55.56,32.58 54.74,31.75 54.3,31.75 R6.1
N$25
  Top 0.406: D3.C 54.23,24 | 54.23,24 54.23,24.51 | 54.03,18.21 54.66,18.21 C20.2 54.48,19.05 54.1,19.05 53.59,19.56 53.59,23.37 54.23,24
  Top 0.813: D4.A 54.03,18.21
N$26
  Top 0.61: 58.49,14.35 58.61,14.35 R7.1
  Top 0.813: C21.2 56.77,13.34 57.78,14.35 58.49,14.35 | R7.1 58.8,14.61 57.66,15.75 57.66,16.18 D4.C
N$27
  Top 0.406: U1.16 P1.5
N$28
  Top 0.508: U7.4 59.82,22.73 C18.1
N$30
  Top 0.508: U7.2 57.28,22.99 C18.2
  Top 0.813: C20.1 55.63,21.34 C18.2
N$31
  Top 0.813: C24.2 58.48,11.18 R8.1 R7.2
N$33
  Top 0.406: U1.15 P1.6
N$34
  Top 0.406: U1.14 P1.7
N$35
  Top 0.406: U1.13 P1.8
N$36
  Top 0.406: U1.12 P1.9
N$37
  Top 0.406: P2.3 U2.18
N$38
  Top 0.406: P2.4 U2.17
N$39
  Top 0.406: P2.5 U2.16
N$40
  Top 0.406: P2.6 U2.15
N$41
  Top 0.406: P2.7 U2.14
N$42
  Top 0.406: P2.8 U2.13
N$43
  Top 0.406: P2.9 U2.12
N$44
  Top 0.406: P3.3 U3.18
N$45
  Top 0.406: U3.17 P3.4
N$46
  Top 0.406: P3.5 U3.16
N$47
  Top 0.406: U3.15 P3.6
N$48
  Top 0.406: U3.14 P3.7
N$49
  Top 0.406: U3.13 P3.8
N$50
  Top 0.406: U3.12 P3.9
N$51
  Top 0.406: P4.3 U4.18
N$52
  Top 0.406: P4.4 U4.17
N$53
  Top 0.406: P4.5 U4.16
N$54
  Top 0.406: P4.6 U4.15
N$55
  Top 0.406: P4.7 U4.14
N$56
  Top 0.406: P4.8 U4.13
N$57
  Top 0.406: P4.9 U4.12
PE
  Top 0.61: X1.12 54.48,57.66 P5.3 R10.1
SELECT
  Top 0.61: X1.13 57.23,57.45 P5.2 57.78,56.64 R9.1
SELT
  Top 0.406: U1.11 48.45,11.81 R1.2
  Bottom 0.406: R18.2 44.51,58.17 46.48,58.17 51.82,52.83 51.82,42.93 51.05,42.16 51.05,21.84 50.1,20.89 C37.2 50.1,13.65 U1.11
STRB  (via drill 0.5)
  Top 0.406: C40.2 20.64,58.68 R4.2 20.57,56.45 R24.1 24.13,56.33 v24.13,54.86
  Bottom 0.406: U4.11 48.26,52.58 46.23,54.61 24.38,54.61 v24.13,54.86
WAIT
  Top 0.61: X1.11 51.74,57.86 P5.4 R11.1

### Text on the board
tPlace: X1 | LED1 | ACK | WAIT | PE | SEL | GND | R4 | C40 | PWR | R5 | R24 | R22 | R21 | R19 | R17 | R16 | R15 | R14 | R13 | FB2 | C4 | P5 | D1 | C9 | GND | U6 | NP! | P4 | R12 | R11 | R10 | R9 | C5 | FB1 | +13V | C6 | P25 | U4 | D2 | P6 | P7 | C10 | P3 | C7 | P22 | R3 | C8 | P8 | GND | C3 | C11 | +10V | P9 | P10 | U3 | C22 | C23 | C12 | P11 | P2 | R6 | R2 | U7 | P12 | C2 | D3 | C13 | P13 | P14 | U2 | C18 | C14 | P15 | C20 | C19 | D4 | P16 | P1 | C15 | Control Board | R1 | P17 | C1 | C21 | R7 | P18 | C24 | C16 | C25 | P19 | R8 | U1 | P20 | P24 | C17 | P21 | P23
bPlace: GND | ACK | WAIT | PE | SEL | R23 | R20 | R18 | GND | D7 | P4 | +13V | P6 | GND | +10V | C39 | P7 | U5 | D7 | P3 | P8 | GND | P9 | +10V | P10 | P22 | P11 | C38 | GND | +10V | P12 | D7 | P2 | P13 | P14 | P15 | C37 | P16 | P17 | D7 | P1 | P18 | -10V | P19 | C36 | C35 | C34 | C33 | C32 | C31 | C30 | C29 | P20 | +20V | GND | P21